# Altium project GL3520-10 SCH_QFN88_Individual_100.PrjPcb
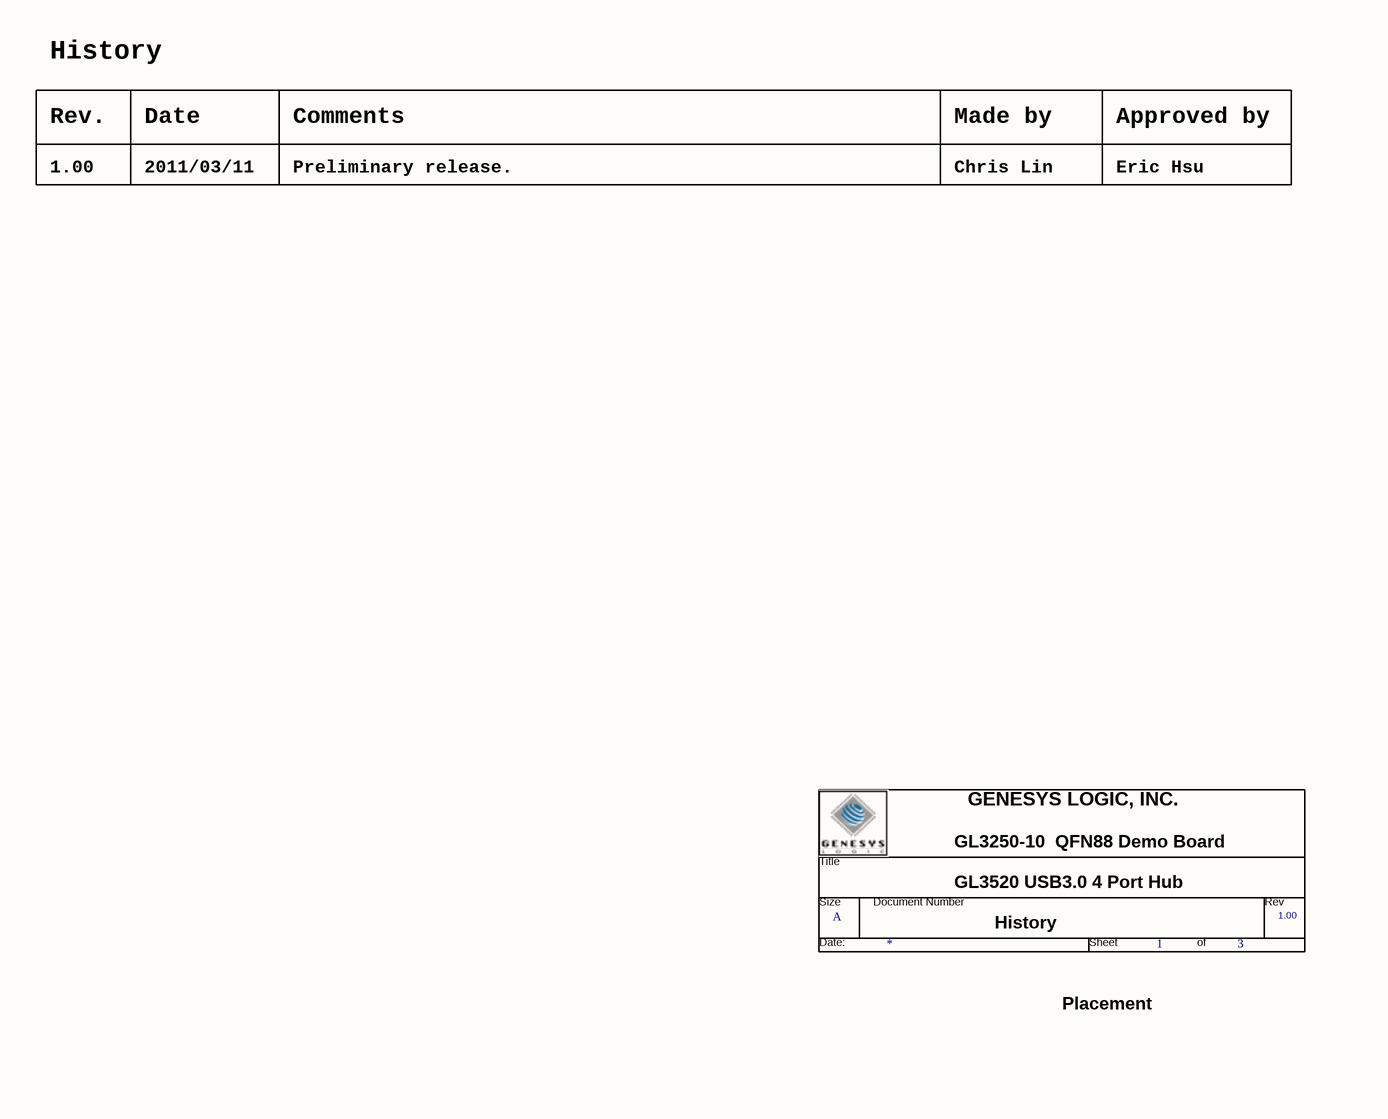
[diagram p0: 1-History.SchDoc, left]
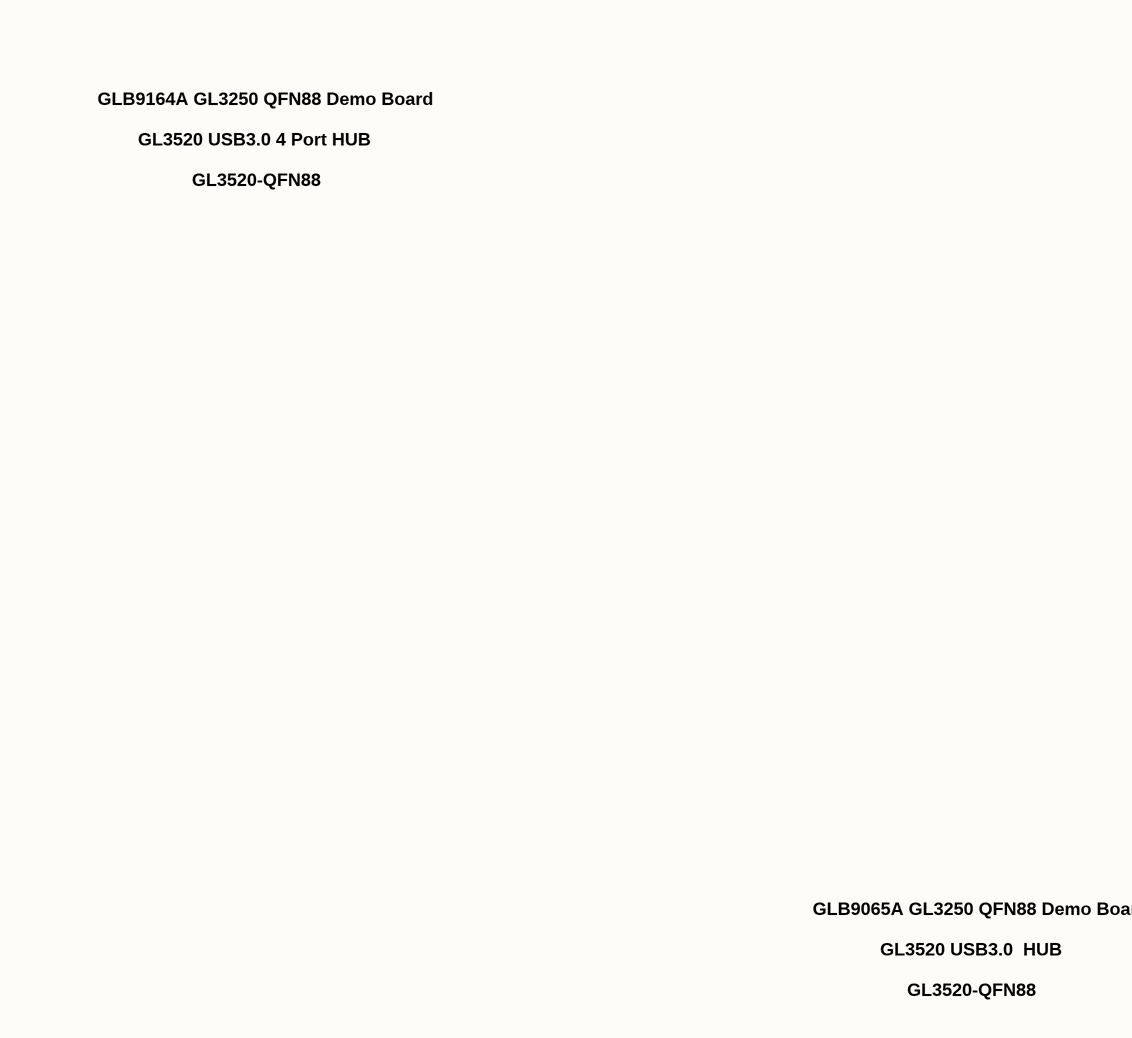
[diagram p1: 1-History.SchDoc, right]
3 sheets, 139 parts. Net scope: flat (ports and power ports of the same name join across sheets).
Sheets:
  1-History.SchDoc
  2.SchDoc
  3.SchDoc

## Sheet 1-History.SchDoc
size 246 x 182 mm

### Parts
(Parts that share a designator on the sheet are numbered #1, #2 ... from top to bottom, then left to right.)
*#1  Page Count: 3  Page Number: 1  Page Size: A  RevCode: 1.00  (hidden comment: Genesys Logic TitleBlock)  (graphical)

### Notes on the sheet
- History
- Rev.
- 1.00
- 2011/03/11
- Date
- Comments
- Preliminary release.
- Chris Lin
- Made by
- Eric Hsu
- Approved by
- GL3250-10  QFN88 Demo Board
- GL3520 USB3.0 4 Port Hub
- Placement
- GLB9164A GL3250 QFN88 Demo Board
- GL3520 USB3.0 4 Port HUB
- GL3520-QFN88
- GLB9065A GL3250 QFN88 Demo Board
- GL3520 USB3.0  HUB
- (in symbol Genesys Logic TitleBlock) GENESYS LOGIC, INC.; Title; Size; Document Number; Rev; Date:; Sheet; of

### Library data of the parts
*#1 = Genesys Logic TitleBlock: Page Create Date: March  8, 1995; Page Modify Date: *

## Sheet 2.SchDoc
size 386 x 246 mm
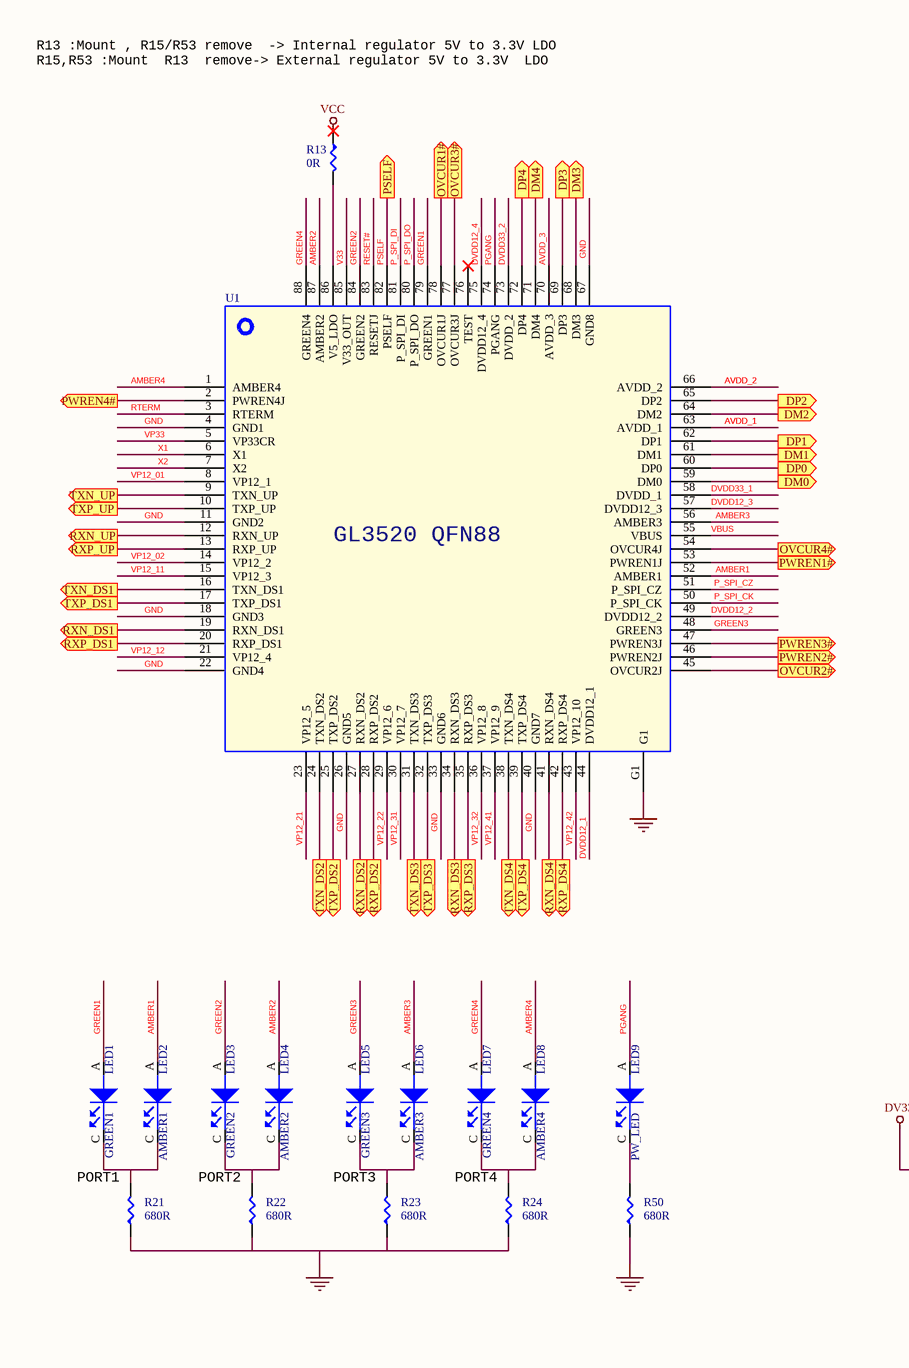
[diagram p2: 2.SchDoc, left]
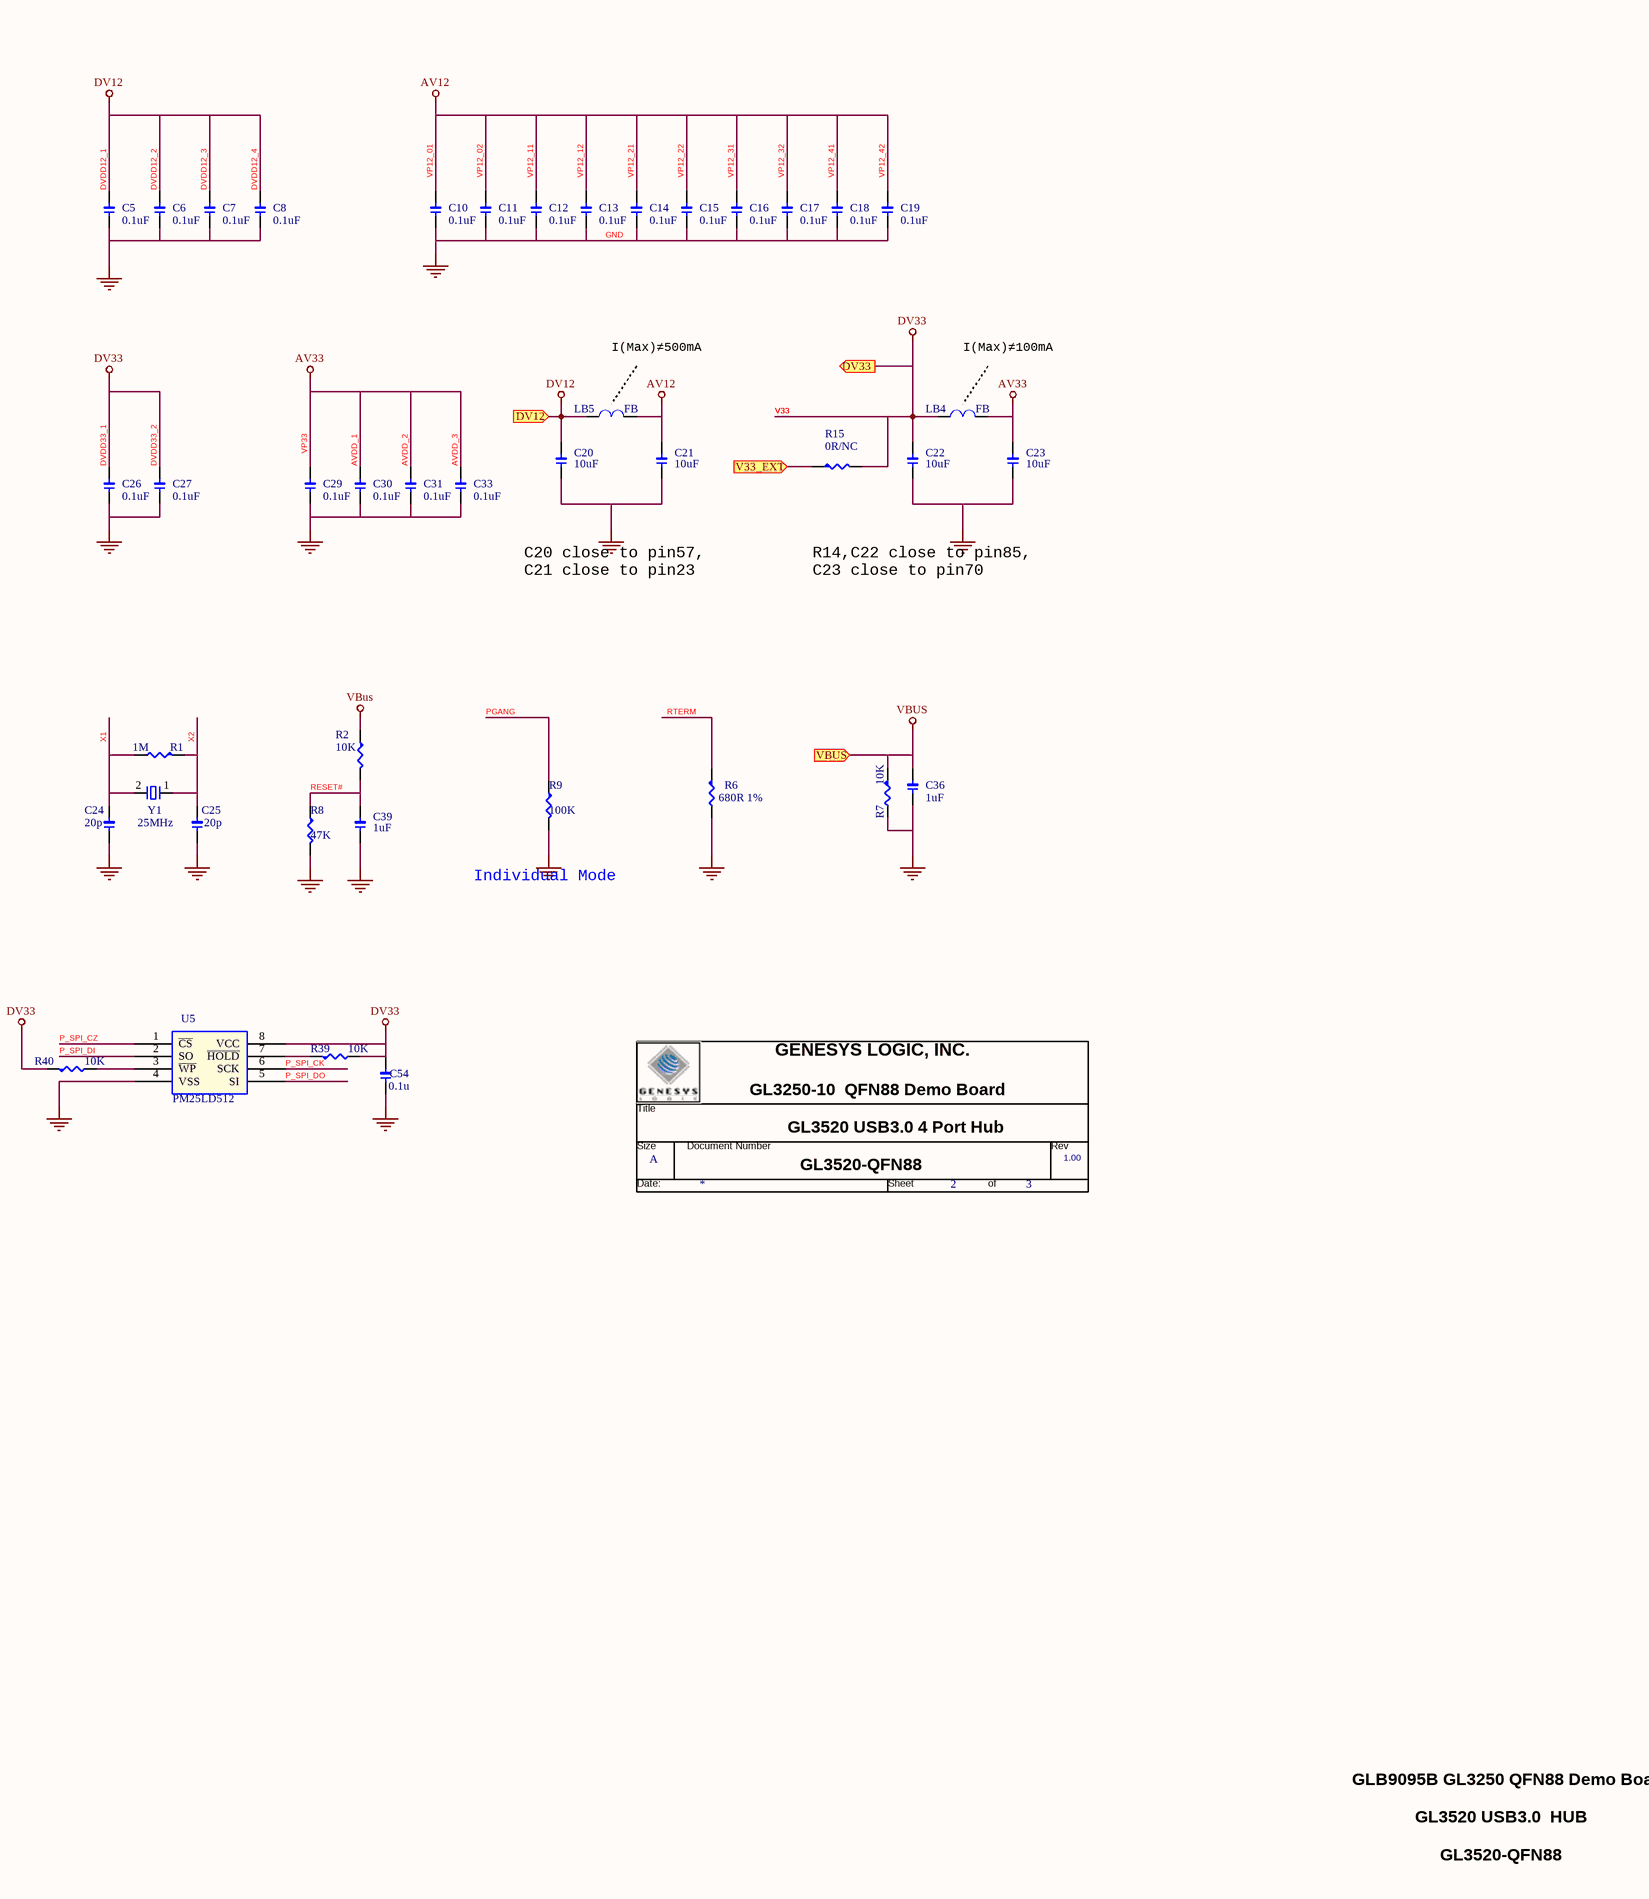
[diagram p3: 2.SchDoc, right]

### Parts
(Parts that share a designator on the sheet are numbered #1, #2 ... from top to bottom, then left to right.)
*#2  Page Count: 3  Page Number: 2  Page Size: A  RevCode: 1.00  (hidden comment: Genesys Logic TitleBlock)  (graphical)
C5  0.1uF  [CCS-0603]
C6  0.1uF  [CCS-0603]
C7  0.1uF  [CCS-0603]
C8  0.1uF  [CCS-0603]
C10  0.1uF  [CCS-0603]
C11  0.1uF  [CCS-0603]
C12  0.1uF  [CCS-0603]
C13  0.1uF  [CCS-0603]
C14  0.1uF  [CCS-0603]
C15  0.1uF  [CCS-0603]
C16  0.1uF  [CCS-0603]
C17  0.1uF  [CCS-0603]
C18  0.1uF  [CCS-0603]
C19  0.1uF  [CCS-0603]
C20  10uF  [CCS-0805]
C21  10uF  [CCS-0805]
C22  10uF  [CCS-0805]
C23  10uF  [CCS-0805]
C24  20p  [CCS-0603]
C25  20p  [CCS-0603]
C26  0.1uF  [CCS-0603]
C27  0.1uF  [CCS-0603]
C29  0.1uF  [CCS-0603]
C30  0.1uF  [CCS-0603]
C31  0.1uF  [CCS-0603]
C33  0.1uF  [CCS-0603]
C36  1uF  [CCS-0603]
C39  1uF  [CCS-0402]
C54  0.1u  [CCS-0603]
LB4  FB  [LBS-0603]
LB5  FB  [LBS-0603]
LED1  GREEN1  [LED-0805]
LED2  AMBER1  [LED-0805]
LED3  GREEN2  [LED-0805]
LED4  AMBER2  [LED-0805]
LED5  GREEN3  [LED-0805]
LED6  AMBER3  [LED-0805]
LED7  GREEN4  [LED-0805]
LED8  AMBER4  [LED-0805]
LED9  PW_LED  [LED-0805]
R1  1M  [R0603]
R2  10K  [RS-0603]
R6  680R 1%  [R0603]
R7  10K  [R0603]
R8  47K  [RS-0603]
R9  100K  [RS-0603]
R13  0R  [RS-0603]
R15  0R/NC  [RS-0603]
R21  680R  [RS-0603]
R22  680R  [RS-0603]
R23  680R  [RS-0603]
R24  680R  [RS-0603]
R39  10K  [R0603]
R40  10K  [R0603]
R50  680R  [RS-0603]
U1  QFN88  [I-LQFP128-0_4A]  (value not drawn)
U5  PM25LD512  [I-SOP8-1_27A]
Y1  25MHz  [XD-49US-A]

### Ports
DM0 (out), DM1 (out), DM2 (out), DM3 (out), DM4 (out), DP0 (out), DP1 (out), DP2 (out), DP3 (out), DP4 (out), DV12 (in), DV33 (out), OVCUR1# (out), OVCUR2# (out), OVCUR3# (out), OVCUR4# (out), PSELF (out), PWREN1# (out), PWREN2# (out), PWREN3# (out), PWREN4# (out), RXN_DS1 (out), RXN_DS2 (out), RXN_DS3 (out), RXN_DS4 (out), RXN_UP (out), RXP_DS1 (out), RXP_DS2 (out), RXP_DS3 (out), RXP_DS4 (out), RXP_UP (out), TXN_DS1 (out), TXN_DS2 (out), TXN_DS3 (out), TXN_DS4 (out), TXN_UP (out), TXP_DS1 (out), TXP_DS2 (out), TXP_DS3 (out), TXP_DS4 (out), TXP_UP (out), V33_EXT (in), VBUS (in)

### Nets
AVDD_1: C23.2 C29.2 C30.2 C31.2 C33.2 LB4.2 U1.5(VP33CR) U1.63(AVDD_1) U1.66(AVDD_2) U1.70(AVDD_3)  [also labelled AV33, AVDD_2, AVDD_3, VP33]
DVDD12_1: C5.2 C6.2 C7.2 C8.2 C20.2 LB5.1 U1.44(DVDD12_1) U1.49(DVDD12_2) U1.57(DVDD12_3) U1.75(DVDD12_4) ; port DV12  [also labelled DV12, DVDD12_2, DVDD12_3, DVDD12_4]
DVDD33_1: C22.2 C26.2 C27.2 C54.2 LB4.1 R15.2 R39.2 R40.1 U1.58(DVDD_1) U1.73(DVDD_2) U1.85(V33_OUT) U5.8(VCC) ; port DV33  [also labelled DV33, DVDD33_2, V33]
GND: C5.1 C6.1 C7.1 C8.1 C10.1 C11.1 C12.1 C13.1 C14.1 C15.1 C16.1 C17.1 C18.1 C19.1 C20.1 C21.1 C22.1 C23.1 C24.1 C25.1 C26.1 C27.1 C29.1 C30.1 C31.1 C33.1 C36.1 C39.1 C54.1 R6.2 R7.2 R8.2 R9.2 R21.1 R22.1 R23.1 R24.1 R50.1 U1.4(GND1) U1.11(GND2) U1.18(GND3) U1.22(GND4) U1.26(GND5) U1.33(GND6) U1.40(GND7) U1.67(GND8) U1.G1 U5.4(VSS)
VBUS: C36.2 R2.1 R7.1 U1.55(VBUS) ; port VBUS
VCC: R13.1
VP12_01: C10.2 C11.2 C12.2 C13.2 C14.2 C15.2 C16.2 C17.2 C18.2 C19.2 C21.2 LB5.2 U1.8(VP12_1) U1.14(VP12_2) U1.15(VP12_3) U1.21(VP12_4) U1.23(VP12_5) U1.29(VP12_6) U1.30(VP12_7) U1.36(VP12_8) U1.37(VP12_9) U1.43(VP12_10)  [also labelled AV12, VP12_02, VP12_11, VP12_12, VP12_21, VP12_22, VP12_31, VP12_32, VP12_41, VP12_42]
AMBER1: LED2.A U1.52(AMBER1)
AMBER2: LED4.A U1.87(AMBER2)
AMBER3: LED6.A U1.56(AMBER3)
AMBER4: LED8.A U1.1(AMBER4)
GREEN1: LED1.A U1.79(GREEN1)
GREEN2: LED3.A U1.84(GREEN2)
GREEN3: LED5.A U1.48(GREEN3)
GREEN4: LED7.A U1.88(GREEN4)
P_SPI_CK: U1.50(P_SPI_CK) U5.6(SCK)
P_SPI_CZ: U1.51(P_SPI_CZ) U5.1(~{CS})
P_SPI_DI: U1.81(P_SPI_DI) U5.2(SO)
P_SPI_DO: U1.80(P_SPI_DO) U5.5(SI)
PGANG: LED9.A R9.1 U1.74(PGANG)
PSELF: U1.82(PSELF) ; port PSELF
RESET#: C39.2 R2.2 R8.1 U1.83(RESETJ)
RTERM: R6.1 U1.3(RTERM)
X1: C24.2 R1.2 U1.6(X1) Y1.2
X2: C25.2 R1.1 U1.7(X2) Y1.1
NetC1_1: U1.9(TXN_UP) ; port TXN_UP
NetC4_1: U1.10(TXP_UP) ; port TXP_UP
NetC34_1: U1.16(TXN_DS1) ; port TXN_DS1
NetC35_1: U1.17(TXP_DS1) ; port TXP_DS1
NetC38_1: U1.24(TXN_DS2) ; port TXN_DS2
NetC40_1: U1.25(TXP_DS2) ; port TXP_DS2
NetC43_1: U1.31(TXN_DS3) ; port TXN_DS3
NetC44_1: U1.32(TXP_DS3) ; port TXP_DS3
NetC45_2: R15.1 ; port V33_EXT
NetC49_1: U1.38(TXN_DS4) ; port TXN_DS4
NetC55_1: U1.39(TXP_DS4) ; port TXP_DS4
NetDOWN1_2: U1.61(DM1) ; port DM1
NetDOWN1_3: U1.62(DP1) ; port DP1
NetDOWN1_5: U1.20(RXP_DS1) ; port RXP_DS1
NetDOWN1_6: U1.19(RXN_DS1) ; port RXN_DS1
NetDOWN2_2: U1.64(DM2) ; port DM2
NetDOWN2_3: U1.65(DP2) ; port DP2
NetDOWN2_5: U1.28(RXP_DS2) ; port RXP_DS2
NetDOWN2_6: U1.27(RXN_DS2) ; port RXN_DS2
NetDOWN3_2: U1.68(DM3) ; port DM3
NetDOWN3_3: U1.69(DP3) ; port DP3
NetDOWN3_5: U1.35(RXP_DS3) ; port RXP_DS3
NetDOWN3_6: U1.34(RXN_DS3) ; port RXN_DS3
NetDOWN4_2: U1.71(DM4) ; port DM4
NetDOWN4_3: U1.72(DP4) ; port DP4
NetDOWN4_5: U1.42(RXP_DS4) ; port RXP_DS4
NetDOWN4_6: U1.41(RXN_DS4) ; port RXN_DS4
NetLED1_C: LED1.C LED2.C R21.2
NetLED3_C: LED3.C LED4.C R22.2
NetLED5_C: LED5.C LED6.C R23.2
NetLED7_C: LED7.C LED8.C R24.2
NetLED9_C: LED9.C R50.2
NetR13_2: R13.2 U1.86(V5_LDO)
NetR28_2: U1.45(OVCUR2J) ; port OVCUR2#
NetR29_2: U1.78(OVCUR1J) ; port OVCUR1#
NetR39_1: R39.1 U5.7(~{HOLD})
NetR40_2: R40.2 U5.3(~{WP})
NetR42_2: U1.54(OVCUR4J) ; port OVCUR4#
NetR43_2: U1.77(OVCUR3J) ; port OVCUR3#
NetU1_2: U1.2(PWREN4J) ; port PWREN4#
NetU1_12: U1.12(RXN_UP) ; port RXN_UP
NetU1_13: U1.13(RXP_UP) ; port RXP_UP
NetU1_46: U1.46(PWREN2J) ; port PWREN2#
NetU1_47: U1.47(PWREN3J) ; port PWREN3#
NetU1_53: U1.53(PWREN1J) ; port PWREN1#
NetU1_59: U1.59(DM0) ; port DM0
NetU1_60: U1.60(DP0) ; port DP0

Not connected (* = marked no-connect by the designer): U1 76(TEST)*

### Notes on the sheet
- R13 :Mount , R15/R53 remove  -> Internal regulator 5V to 3.3V LDO
  R15,R53 :Mount  R13  remove-> External regulator 5V to 3.3V  LDO
- I(Max)≠500mA
- I(Max)≠100mA
- C20 close to pin57,
  C21 close to pin23
- R14,C22 close to pin85,
  C23 close to pin70
- Individual Mode
- (near R21) PORT1
- (near R22) PORT2
- (near R23) PORT3
- (near R24) PORT4
- GL3250-10  QFN88 Demo Board
- GL3520 USB3.0 4 Port Hub
- GL3520-QFN88
- GLB9095B GL3250 QFN88 Demo Board
- GL3520 USB3.0  HUB
- (in symbol Genesys Logic TitleBlock) GENESYS LOGIC, INC.; Title; Size; Document Number; Rev; Date:; Sheet; of
- (in symbol GL3520_QFN88_V094-1_18) GL3520 QFN88

### Library data of the parts
C5-C8 C10-C19 C24-C27 C29-C31 C33 C36 = C-0603 5%: xGLA pn: 10-00005-01; PCB Footprint: CCS-0603
C20-C23 = C-0805: PCB Footprint: CCS-0805
C39 = C-0402: PCB Footprint: CCS-0603
C54 = C-0603 5%: BOM: SMD-CAP 10pF (0603) 5%; PCB Footprint: CCS-0603
LB4 LB5 = L-0603: PCB Footprint: LBS-0603
LED1-LED9 = LED-0805: PCB Footprint: LED-0805
R1 = R330-0603 5%: CLASS: DISCRETE; BOM: SMD-R 330 (0603) 5%; xGLA pn: 13-00009-01; PCB Footprint: RS-0603
R2 R8 R9 R13 R15 R21-R24 R50 = R-0603: PCB Footprint: RS-0603
R6 R39 R40 = R-0603 5%: CLASS: DISCRETE; BOM: SMD-R ?K (0603) 5%; PCB Footprint: RS-0603
R7 = R-0603 5%: CLASS: DISCRETE; BOM: SMD-R ?K (0603) 5%; PCB Footprint: RS-0805
U1 = GL3520_QFN88_V094-1_18: PCB Footprint: I-QFN88-10X10X0_4A
U5 = CAT25C128/256: PCB Footprint: I-SOP8-1_27A
Y1 = XTAL-HALF: BOM: DIP-XTAL ?MHz HALF <TXC>; PCB Footprint: XS-49US-A; xGLA pn: 24-00002-01
*#2 = Genesys Logic TitleBlock: Page Create Date: March  8, 1995; Page Modify Date: *

## Sheet 3.SchDoc
size 420 x 297 mm
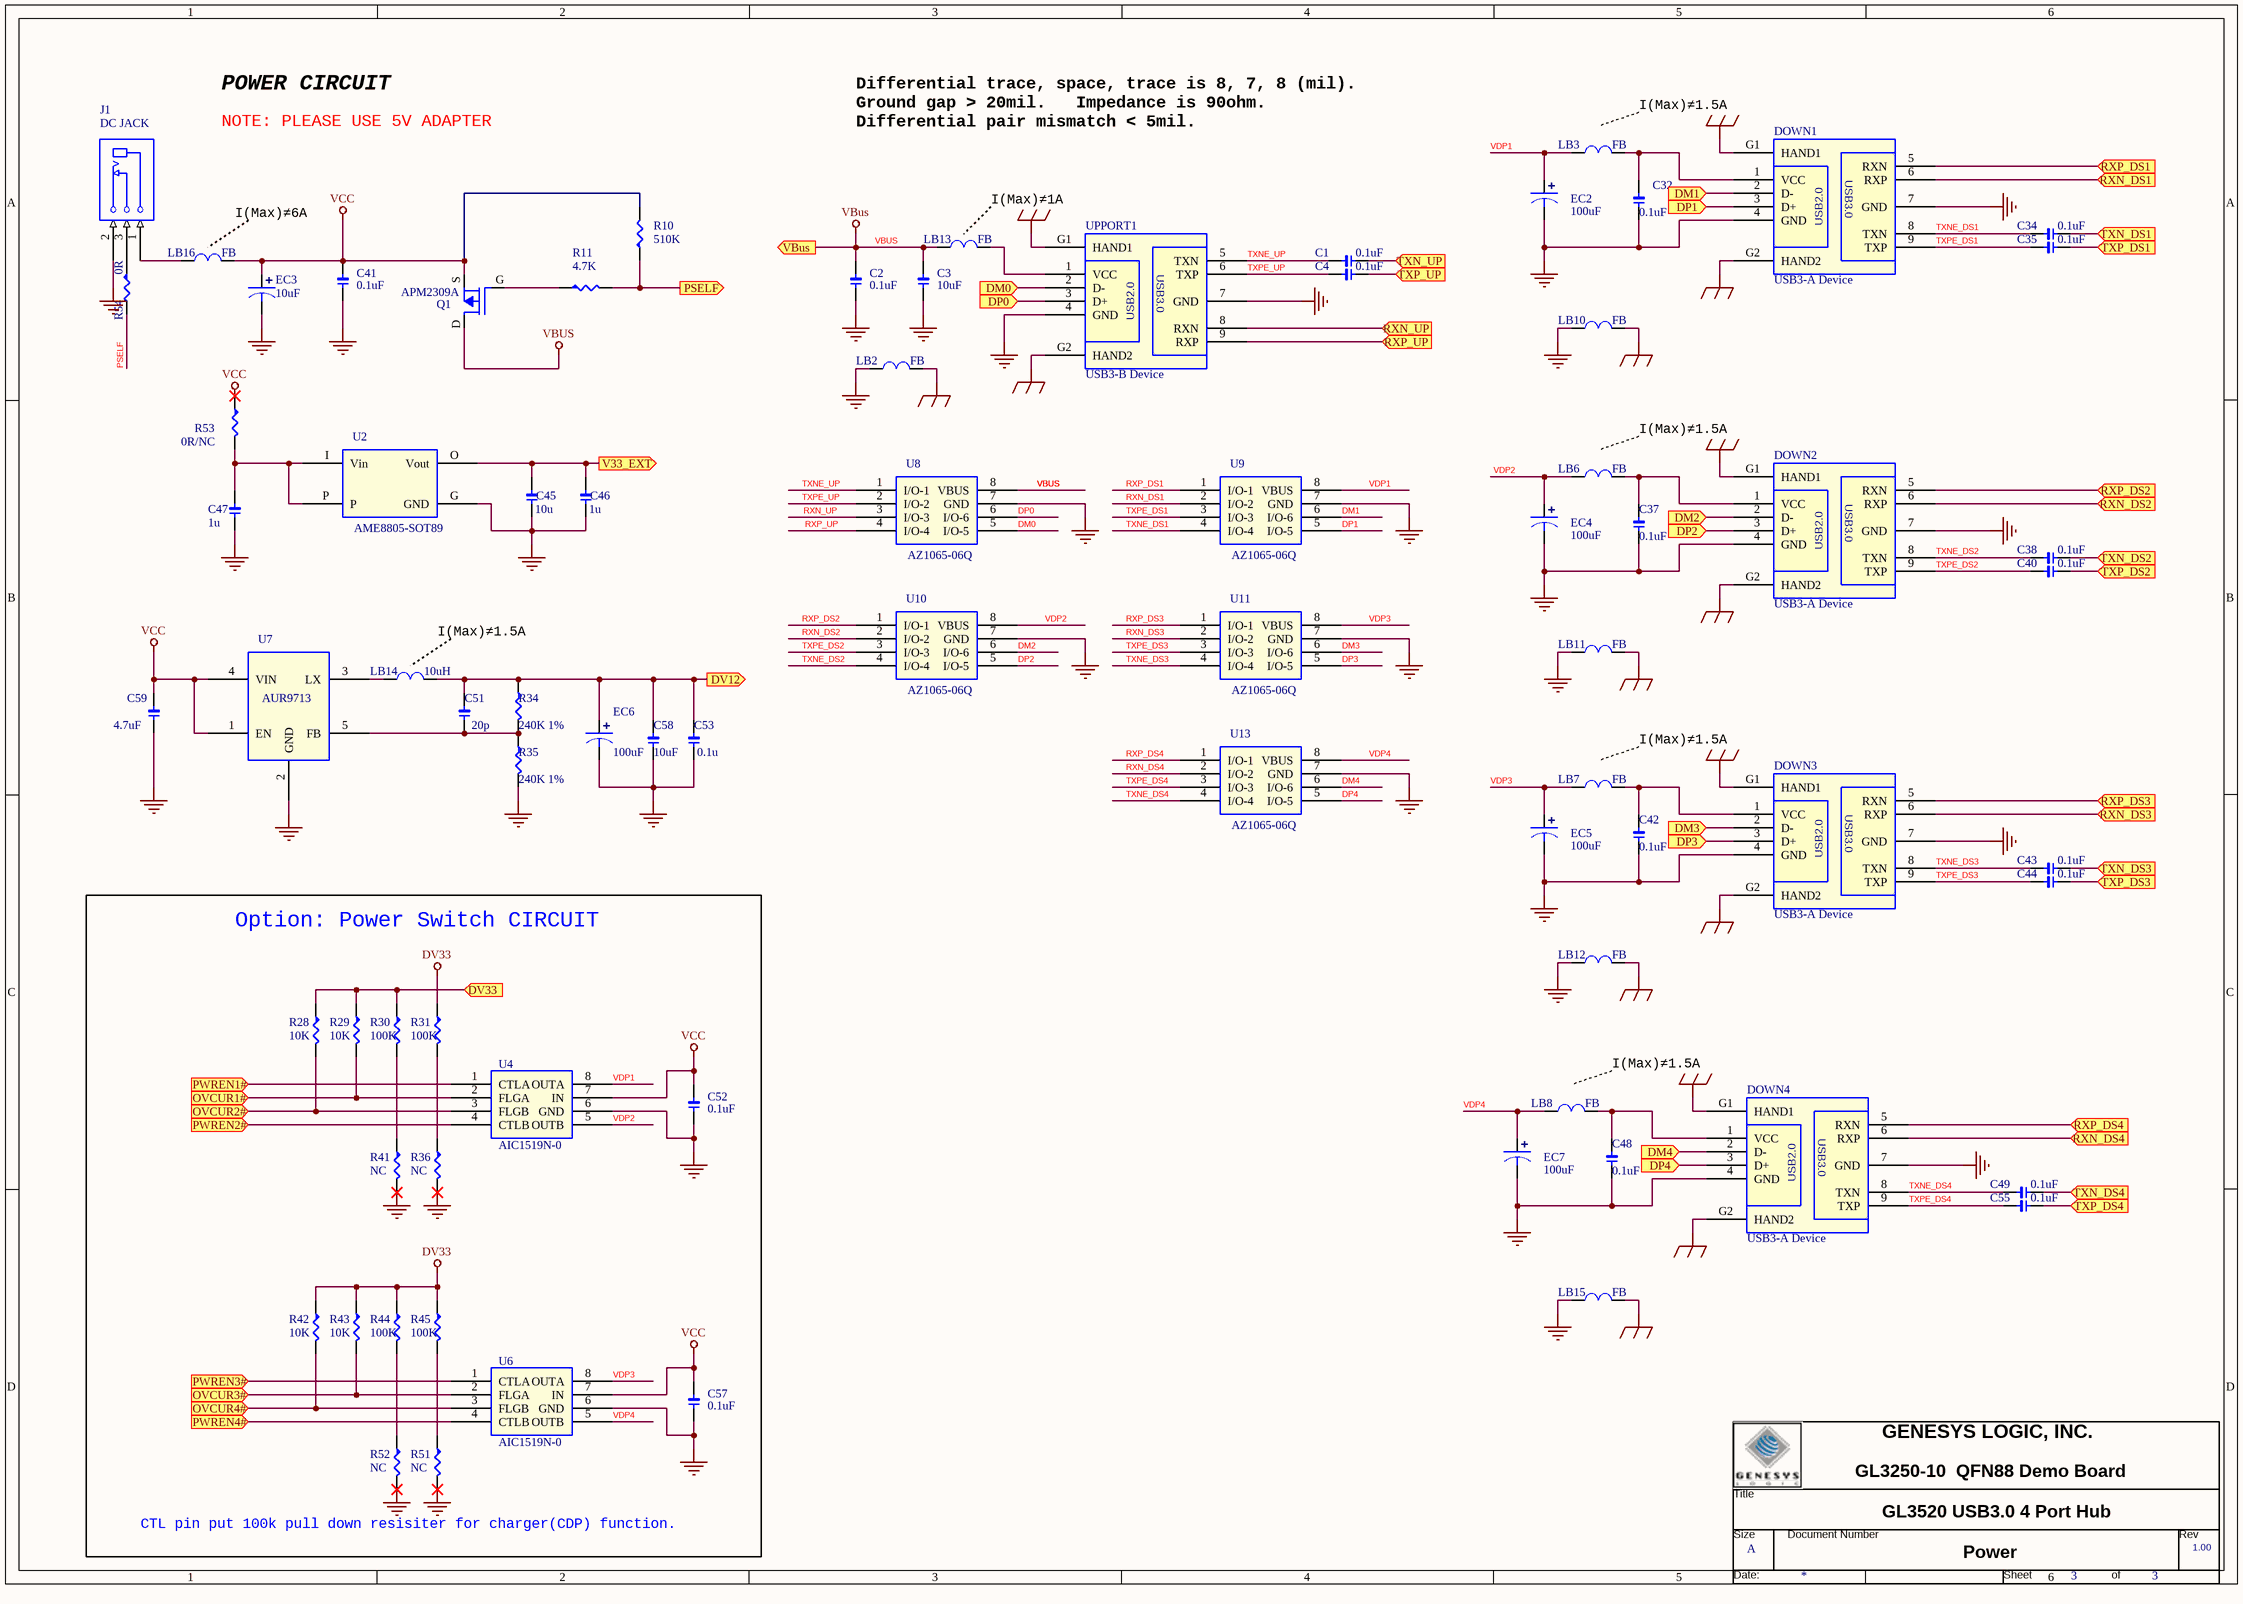
[diagram p4: 3.SchDoc]

### Parts
(Parts that share a designator on the sheet are numbered #1, #2 ... from top to bottom, then left to right.)
*#3  Page Count: 3  Page Size: A  RevCode: 1.00  (hidden comment: Genesys Logic TitleBlock)  (graphical)
C1  0.1uF  [CCS-0402]
C2  0.1uF  [CCS-0402]
C3  10uF  [CCS-0402]
C4  0.1uF  [CCS-0402]
C32  0.1uF  [CCS-0402]
C34  0.1uF  [CCS-0402]
C35  0.1uF  [CCS-0402]
C37  0.1uF  [CCS-0402]
C38  0.1uF  [CCS-0402]
C40  0.1uF  [CCS-0402]
C41  0.1uF  [CCS-0603]
C42  0.1uF  [CCS-0402]
C43  0.1uF  [CCS-0402]
C44  0.1uF  [CCS-0402]
C45  10u  [CCS-0603]
C46  1u  [CCS-0603]
C47  1u  [CCS-0603]
C48  0.1uF  [CCS-0402]
C49  0.1uF  [CCS-0402]
C51  20p  [CCS-0603]
C52  0.1uF  [CCS-0402]
C53  0.1u  [CCS-0603]
C55  0.1uF  [CCS-0402]
C57  0.1uF  [CCS-0402]
C58  10uF  [CCS-0805]
C59  4.7uF  [CCS-0805]
DOWN1  USB3-A Device  [CND-USB3-A]
DOWN2  USB3-A Device  [CND-USB3-A]
DOWN3  USB3-A Device  [CND-USB3-A]
DOWN4  USB3-A Device  [CND-USB3-A]
EC2  100uF  [CED-6_3-2_5]
EC3  10uF  [CED-5-2_5]
EC4  100uF  [CED-6_3-2_5]
EC5  100uF  [CED-6_3-2_5]
EC6  100uF  [CED-5-2_5]
EC7  100uF  [CED-6_3-2_5]
J1  DC JACK  [CND-DCJ-A]
LB2  FB  [LBS-0603]
LB3  FB  [LBS-0603]
LB6  FB  [LBS-0603]
LB7  FB  [LBS-0603]
LB8  FB  [LBS-0603]
LB10  FB  [LBS-0603]
LB11  FB  [LBS-0603]
LB12  FB  [LBS-0603]
LB13  FB  [LBS-0603]
LB14  10uH  [LBS-0805]
LB15  FB  [LBS-0603]
LB16  FB  [LBS-0603]
Q1  APM2309A  [T-SOT23-GSD-A]
R10  510K  [RS-0603]
R11  4.7K  [RS-0603]
R28  10K  [RS-0402]
R29  10K  [RS-0402]
R30  100K  [RS-0402]
R31  100K  [RS-0402]
R34  240K 1%  [R0603]
R35  240K 1%  [R0603]
R36  NC  [RS-0402]
R41  NC  [RS-0402]
R42  10K  [RS-0402]
R43  10K  [RS-0402]
R44  100K  [RS-0402]
R45  100K  [RS-0402]
R51  NC  [RS-0402]
R52  NC  [RS-0402]
R53  0R/NC  [R0603]
R54  0R  [R0603]
U2  AME8805-SOT89  [I-SOT89-GIO-A]
U4  AIC1519N-0  [I-SOP8-1_27A]
U6  AIC1519N-0  [I-SOP8-1_27A]
U7  AUR9713  [I-TSOT23-5P-2_9x1_6x0_95A]
U8  AZ1065-06Q  [i-sop8-0_65a]
U9  AZ1065-06Q  [i-sop8-0_65a]
U10  AZ1065-06Q  [i-sop8-0_65a]
U11  AZ1065-06Q  [i-sop8-0_65a]
U13  AZ1065-06Q  [i-sop8-0_65a]
UPPORT1  USB3-B Device  [CND-USB3-A]

### Blocks framed on the sheet
Option: Power Switch CIRCUIT: C52 C57 R28-R31 R36 R41-R45 R51 R52 U4 U6

### Ports
DM0 (in), DM1 (in), DM2 (in), DM3 (in), DM4 (in), DP0 (in), DP1 (in), DP2 (in), DP3 (in), DP4 (in), DV12 (out), DV33 (in), OVCUR1# (in), OVCUR2# (in), OVCUR3# (in), OVCUR4# (in), PSELF (out), PWREN1# (in), PWREN2# (in), PWREN3# (in), PWREN4# (in), RXN_DS1 (in), RXN_DS2 (in), RXN_DS3 (in), RXN_DS4 (in), RXN_UP (in), RXP_DS1 (in), RXP_DS2 (in), RXP_DS3 (in), RXP_DS4 (in), RXP_UP (in), TXN_DS1 (in), TXN_DS2 (in), TXN_DS3 (in), TXN_DS4 (in), TXN_UP (in), TXP_DS1 (in), TXP_DS2 (in), TXP_DS3 (in), TXP_DS4 (in), TXP_UP (in), V33_EXT (out), VBus (out)

### Nets
DV33: R28.1 R29.1 R30.1 R31.1 R42.1 R43.1 R44.1 R45.1 ; port DV33  [project net DVDD33_1]
DVDD12_1: C51.2 C53.2 C58.2 EC6.1 LB14.2 R34.1 ; port DV12
EGND: DOWN1.G1(HAND1) DOWN1.G2(HAND2) DOWN2.G1(HAND1) DOWN2.G2(HAND2) DOWN3.G1(HAND1) DOWN3.G2(HAND2) DOWN4.G1(HAND1) DOWN4.G2(HAND2) LB2.2 LB10.2 LB11.2 LB12.2 LB15.2 UPPORT1.G1(HAND1) UPPORT1.G2(HAND2)
GND: C2.1 C3.1 C32.1 C37.1 C41.1 C42.1 C45.1 C46.1 C47.1 C48.1 C52.1 C53.1 C57.1 C58.1 C59.1 DOWN1.4(GND) DOWN1.7(GND) DOWN2.4(GND) DOWN2.7(GND) DOWN3.4(GND) DOWN3.7(GND) DOWN4.4(GND) DOWN4.7(GND) EC2.2 EC3.2 EC4.2 EC5.2 EC6.2 EC7.2 J1.2(3T) LB2.1 LB10.1 LB11.1 LB12.1 LB15.1 R35.2 R36.2 R41.2 R51.2 R52.2 U2.G(GND) U4.6(GND) U6.6(GND) U7.2(GND) U8.7(GND) U9.7(GND) U10.7(GND) U11.7(GND) U13.7(GND) UPPORT1.4(GND) UPPORT1.7(GND)
VBUS: C2.2 C3.2 LB13.1 Q1.D U8.8(VBUS) ; port VBus
VCC: C41.2 C52.2 C57.2 C59.2 EC3.1 LB16.2 Q1.S R10.2 R53.1 U4.7(IN) U6.7(IN) U7.1(EN) U7.4(VIN)
DM0: U8.5(I/O-5)
DM1: U9.6(I/O-6)
DM2: U10.6(I/O-6)
DM3: U11.6(I/O-6)
DM4: U13.6(I/O-6)
DP0: U8.6(I/O-6)
DP1: U9.5(I/O-5)
DP2: U10.5(I/O-5)
DP3: U11.5(I/O-5)
DP4: U13.5(I/O-5)
PSELF: R10.1 R11.2 ; port PSELF
PSELF: R54.2  [a separate net that carries the same name]
RXN_DS1: U9.2(I/O-2)
RXN_DS2: U10.2(I/O-2)
RXN_DS3: U11.2(I/O-2)
RXN_DS4: U13.2(I/O-2)
RXN_UP: U8.3(I/O-3)
RXP_DS1: U9.1(I/O-1)
RXP_DS2: U10.1(I/O-1)
RXP_DS3: U11.1(I/O-1)
RXP_DS4: U13.1(I/O-1)
RXP_UP: U8.4(I/O-4)
TXNE_DS1: C34.2 DOWN1.8(TXN) U9.4(I/O-4)
TXNE_DS2: C38.2 DOWN2.8(TXN) U10.4(I/O-4)
TXNE_DS3: C43.2 DOWN3.8(TXN) U11.4(I/O-4)
TXNE_DS4: C49.2 DOWN4.8(TXN) U13.4(I/O-4)
TXNE_UP: C1.2 U8.1(I/O-1) UPPORT1.5(TXN)
TXPE_DS1: C35.2 DOWN1.9(TXP) U9.3(I/O-3)
TXPE_DS2: C40.2 DOWN2.9(TXP) U10.3(I/O-3)
TXPE_DS3: C44.2 DOWN3.9(TXP) U11.3(I/O-3)
TXPE_DS4: C55.2 DOWN4.9(TXP) U13.3(I/O-3)
TXPE_UP: C4.2 U8.2(I/O-2) UPPORT1.6(TXP)
VDP1: EC2.1 LB3.1 U4.8(OUTA) U9.8(VBUS)
VDP2: EC4.1 LB6.1 U4.5(OUTB) U10.8(VBUS)
VDP3: EC5.1 LB7.1 U6.8(OUTA) U11.8(VBUS)
VDP4: EC7.1 LB8.1 U6.5(OUTB) U13.8(VBUS)
NetC1_1: C1.1 ; port TXN_UP
NetC4_1: C4.1 ; port TXP_UP
NetC32_2: C32.2 DOWN1.1(VCC) LB3.2
NetC34_1: C34.1 ; port TXN_DS1
NetC35_1: C35.1 ; port TXP_DS1
NetC37_2: C37.2 DOWN2.1(VCC) LB6.2
NetC38_1: C38.1 ; port TXN_DS2
NetC40_1: C40.1 ; port TXP_DS2
NetC42_2: C42.2 DOWN3.1(VCC) LB7.2
NetC43_1: C43.1 ; port TXN_DS3
NetC44_1: C44.1 ; port TXP_DS3
NetC45_2: C45.2 C46.2 U2.O(Vout) ; port V33_EXT
NetC47_2: C47.2 R53.2 U2.I(Vin) U2.P
NetC48_2: C48.2 DOWN4.1(VCC) LB8.2
NetC49_1: C49.1 ; port TXN_DS4
NetC51_1: C51.1 R34.2 R35.1 U7.5(FB)
NetC55_1: C55.1 ; port TXP_DS4
NetDOWN1_2: DOWN1.2(D-) ; port DM1
NetDOWN1_3: DOWN1.3(D+) ; port DP1
NetDOWN1_5: DOWN1.5(RXN) ; port RXP_DS1
NetDOWN1_6: DOWN1.6(RXP) ; port RXN_DS1
NetDOWN2_2: DOWN2.2(D-) ; port DM2
NetDOWN2_3: DOWN2.3(D+) ; port DP2
NetDOWN2_5: DOWN2.5(RXN) ; port RXP_DS2
NetDOWN2_6: DOWN2.6(RXP) ; port RXN_DS2
NetDOWN3_2: DOWN3.2(D-) ; port DM3
NetDOWN3_3: DOWN3.3(D+) ; port DP3
NetDOWN3_5: DOWN3.5(RXN) ; port RXP_DS3
NetDOWN3_6: DOWN3.6(RXP) ; port RXN_DS3
NetDOWN4_2: DOWN4.2(D-) ; port DM4
NetDOWN4_3: DOWN4.3(D+) ; port DP4
NetDOWN4_5: DOWN4.5(RXN) ; port RXP_DS4
NetDOWN4_6: DOWN4.6(RXP) ; port RXN_DS4
NetJ1_1: J1.1(1S) LB16.1
NetJ1_3: J1.3(2TS) R54.1
NetLB13_2: LB13.2 UPPORT1.1(VCC)
NetLB14_1: LB14.1 U7.3(LX)
NetQ1_G: Q1.G R11.1
NetR28_2: R28.2 U4.3(FLGB) ; port OVCUR2#
NetR29_2: R29.2 U4.2(FLGA) ; port OVCUR1#
NetR30_2: R30.2 R41.1
NetR31_2: R31.2 R36.1
NetR42_2: R42.2 U6.3(FLGB) ; port OVCUR4#
NetR43_2: R43.2 U6.2(FLGA) ; port OVCUR3#
NetR44_2: R44.2 R52.1
NetR45_2: R45.2 R51.1
NetU1_2: U6.4(CTLB) ; port PWREN4#
NetU1_12: UPPORT1.8(RXN) ; port RXN_UP
NetU1_13: UPPORT1.9(RXP) ; port RXP_UP
NetU1_46: U4.4(CTLB) ; port PWREN2#
NetU1_47: U6.1(CTLA) ; port PWREN3#
NetU1_53: U4.1(CTLA) ; port PWREN1#
NetU1_59: UPPORT1.2(D-) ; port DM0
NetU1_60: UPPORT1.3(D+) ; port DP0

### Notes on the sheet
- NOTE: PLEASE USE 5V ADAPTER
- POWER CIRCUIT
- I(Max)≠1.5A
- Differential trace, space, trace is 8, 7, 8 (mil).
  Ground gap > 20mil.   Impedance is 90ohm.
  Differential pair mismatch < 5mil.
- I(Max)≠6A
- I(Max)≠1A
- GL3250-10  QFN88 Demo Board
- CTL pin put 100k pull down resisiter for charger(CDP) function.
- GL3520 USB3.0 4 Port Hub
- Power
- (in symbol CED-5-2_5) +
- (in symbol CED-6_3-2_5) +
- (in symbol Genesys Logic TitleBlock) GENESYS LOGIC, INC.; Title; Size; Document Number; Rev; Date:; Sheet; of
- (in symbol USB3-A_4) USB3.0; USB2.0
- (in symbol USB3-A_5) USB3.0; USB2.0
- (in symbol USB3-A_6) USB3.0; USB2.0
- (in symbol USB3-A_7) USB3.0; USB2.0

### Library data of the parts
C1 C4 C34 C35 C38 C40 C43 C44 C49 C55 = C-0402: PCB Footprint: CCS-0402O
C2 C3 C32 C37 C42 C48 C52 C57 = C-0402: PCB Footprint: CCS-0603
C41 = C-0603: PCB Footprint: CCS-0603
C45-C47 C51 C53 = C-0603 5%: BOM: SMD-CAP 10pF (0603) 5%; PCB Footprint: CCS-0603
C58 C59 = C-0805: PCB Footprint: CCS-0805
DOWN1 = USB3-A_5: PCB Footprint: CND-USB3A-A
DOWN2 = USB3-A_6: PCB Footprint: CND-USB3A-A
DOWN3 DOWN4 = USB3-A_7: PCB Footprint: CND-USB3A-A
EC2 EC4 EC5 EC7 = CED-6_3-2_5: PCB Footprint: CED-6_3-2_5
EC3 EC6 = CED-5-2_5: PCB Footprint: CED-5-2_5
LB2 LB3 LB6-LB8 LB10-LB13 LB15 LB16 = L-0603
  LB2 LB3 LB6-LB8 LB10-LB13 LB15: PCB Footprint: LBS-0603
  LB16: PCB Footprint: LBS-0805
LB14 = FB-0805: PCB Footprint: LCS-ETP0502-5x6x4_0A
Q1 = FDN360-GSD: PCB Footprint: T-SOT23-GSD-A
R10 R11 = R-0603: PCB Footprint: RS-0603
R28-R31 R36 R41-R45 R51 R52 = R-0402: PCB Footprint: RS-0603
R34 R35 R53 R54 = R-0603 5%: as R6 on sheet 2
U4 U6 = AIC1526-SOP: PCB Footprint: I-SOP8-1_27A
U7 = AUR9705_3: PCB Footprint: I-TSOT23-5P-2_9x1_6x0_95A
U8-U11 U13 = CAT25C128/256_0: PCB Footprint: i-sop8-0_65a
UPPORT1 = USB3-A_4: PCB Footprint: CND-USB3B-B
*#3 = Genesys Logic TitleBlock: Page Number: 3; Page Create Date: March  8, 1995; Page Modify Date: *
J1 = DC JACK: PCB Footprint: CND-DCJ-A
U2 = AME8805-SOT89: PCB Footprint: I-SOT89-GIO-A

## Nets that join several sheets
DVDD12_1: 2 (10 pins), 3 (6 pins)
DVDD33_1: 2 (12 pins), 3 (8 pins)
GND: 2 (48 pins), 3 (51 pins)
VBUS: 2 (C36.2 R2.1 R7.1 U1.55), 3 (5 pins)
VCC: 2 (R13.1), 3 (13 pins)
NetC1_1: 2 (U1.9), 3 (C1.1)
NetC4_1: 2 (U1.10), 3 (C4.1)
NetC34_1: 2 (U1.16), 3 (C34.1)
NetC35_1: 2 (U1.17), 3 (C35.1)
NetC38_1: 2 (U1.24), 3 (C38.1)
NetC40_1: 2 (U1.25), 3 (C40.1)
NetC43_1: 2 (U1.31), 3 (C43.1)
NetC44_1: 2 (U1.32), 3 (C44.1)
NetC45_2: 2 (R15.1), 3 (C45.2 C46.2 U2.O)
NetC49_1: 2 (U1.38), 3 (C49.1)
NetC55_1: 2 (U1.39), 3 (C55.1)
NetDOWN1_2: 2 (U1.61), 3 (DOWN1.2)
NetDOWN1_3: 2 (U1.62), 3 (DOWN1.3)
NetDOWN1_5: 2 (U1.20), 3 (DOWN1.5)
NetDOWN1_6: 2 (U1.19), 3 (DOWN1.6)
NetDOWN2_2: 2 (U1.64), 3 (DOWN2.2)
NetDOWN2_3: 2 (U1.65), 3 (DOWN2.3)
NetDOWN2_5: 2 (U1.28), 3 (DOWN2.5)
NetDOWN2_6: 2 (U1.27), 3 (DOWN2.6)
NetDOWN3_2: 2 (U1.68), 3 (DOWN3.2)
NetDOWN3_3: 2 (U1.69), 3 (DOWN3.3)
NetDOWN3_5: 2 (U1.35), 3 (DOWN3.5)
NetDOWN3_6: 2 (U1.34), 3 (DOWN3.6)
NetDOWN4_2: 2 (U1.71), 3 (DOWN4.2)
NetDOWN4_3: 2 (U1.72), 3 (DOWN4.3)
NetDOWN4_5: 2 (U1.42), 3 (DOWN4.5)
NetDOWN4_6: 2 (U1.41), 3 (DOWN4.6)
NetR28_2: 2 (U1.45), 3 (R28.2 U4.3)
NetR29_2: 2 (U1.78), 3 (R29.2 U4.2)
NetR42_2: 2 (U1.54), 3 (R42.2 U6.3)
NetR43_2: 2 (U1.77), 3 (R43.2 U6.2)
NetU1_2: 2 (U1.2), 3 (U6.4)
NetU1_12: 2 (U1.12), 3 (UPPORT1.8)
NetU1_13: 2 (U1.13), 3 (UPPORT1.9)
NetU1_46: 2 (U1.46), 3 (U4.4)
NetU1_47: 2 (U1.47), 3 (U6.1)
NetU1_53: 2 (U1.53), 3 (U4.1)
NetU1_59: 2 (U1.59), 3 (UPPORT1.2)
NetU1_60: 2 (U1.60), 3 (UPPORT1.3)
PSELF: 2 (U1.82), 3 (R10.1 R11.2)